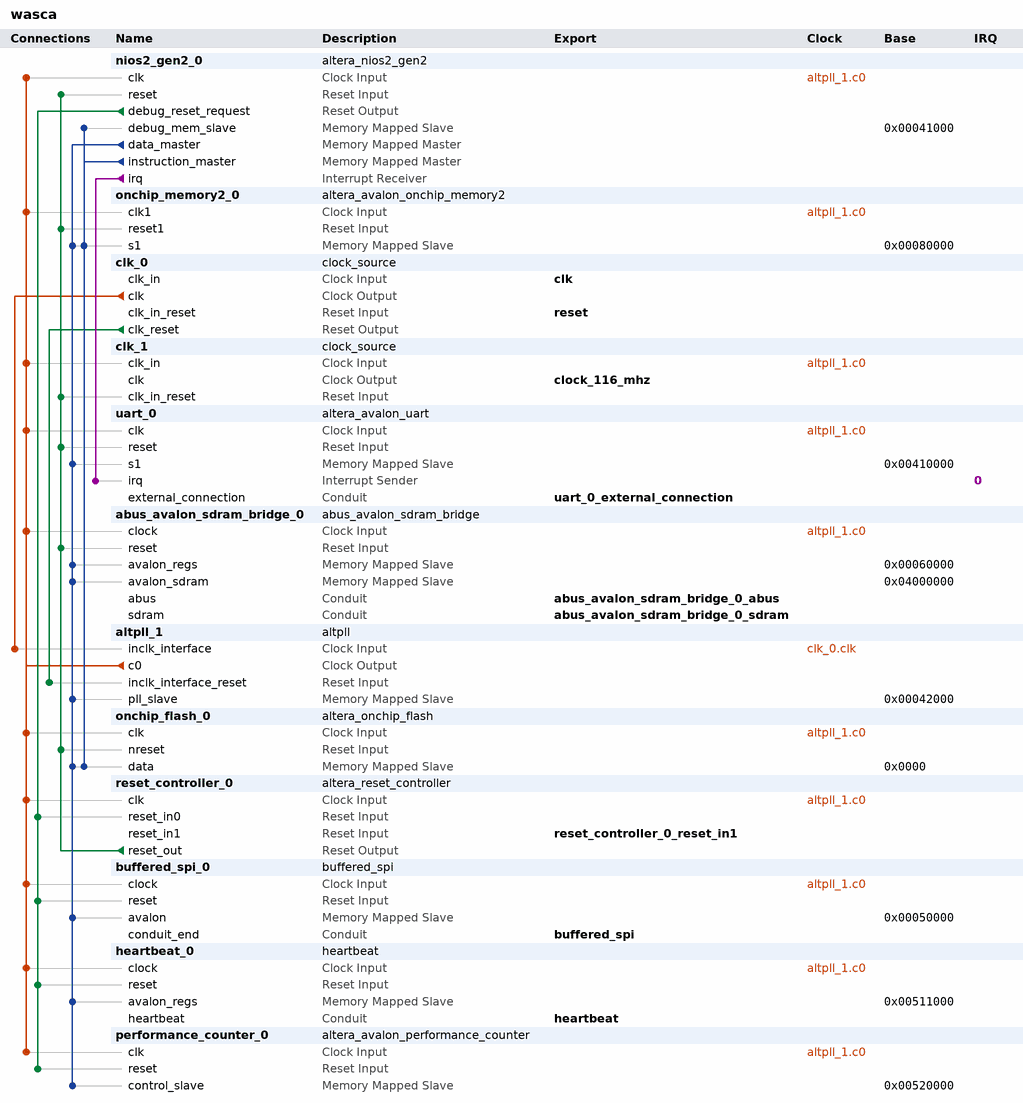
[diagram p0: system contents]
# Platform Designer (Qsys) system wasca, MAX 10 10M08SCE144C8G
# Parameters at their usual value, and those the tool derives, are not listed.
package require -exact qsys 18.1
create_system wasca
set_project_property DEVICE_FAMILY {MAX 10}
set_project_property DEVICE 10M08SCE144C8G

add_instance nios2_gen2_0 altera_nios2_gen2 18.1
set_instance_parameter_value nios2_gen2_0 dcache_size 0
set_instance_parameter_value nios2_gen2_0 debug_hwbreakpoint 4
set_instance_parameter_value nios2_gen2_0 exceptionOffset 16352
set_instance_parameter_value nios2_gen2_0 exceptionSlave onchip_flash_0.data
set_instance_parameter_value nios2_gen2_0 icache_size 0
set_instance_parameter_value nios2_gen2_0 impl Tiny
set_instance_parameter_value nios2_gen2_0 resetSlave onchip_flash_0.data
set_instance_parameter_value nios2_gen2_0 resetrequest_enabled false

add_instance onchip_memory2_0 altera_avalon_onchip_memory2 18.1
set_instance_parameter_value onchip_memory2_0 dataWidth 32
set_instance_parameter_value onchip_memory2_0 dualPort false
set_instance_parameter_value onchip_memory2_0 initMemContent false
set_instance_parameter_value onchip_memory2_0 initializationFileName onchip_mem.hex
set_instance_parameter_value onchip_memory2_0 memorySize 24576

add_instance clk_0 clock_source 18.1
set_instance_parameter_value clk_0 clockFrequency 8000000

add_instance clk_1 clock_source 18.1
set_instance_parameter_value clk_1 clockFrequency 116000000
set_instance_parameter_value clk_1 resetSynchronousEdges BOTH

add_instance uart_0 altera_avalon_uart 18.1
set_instance_parameter_value uart_0 baud 115200
set_instance_parameter_value uart_0 dataBits 8
set_instance_parameter_value uart_0 fixedBaud false
set_instance_parameter_value uart_0 parity NONE
set_instance_parameter_value uart_0 stopBits 1

add_instance abus_avalon_sdram_bridge_0 abus_avalon_sdram_bridge 1.0

add_instance altpll_1 altpll 18.1
set_instance_parameter_value altpll_1 CLK0_DIVIDE_BY 2
set_instance_parameter_value altpll_1 CLK0_MULTIPLY_BY 29
set_instance_parameter_value altpll_1 INCLK0_INPUT_FREQUENCY 125000
set_instance_parameter_value altpll_1 PORT_ARESET PORT_UNUSED
set_instance_parameter_value altpll_1 PORT_LOCKED PORT_UNUSED
set_instance_parameter_value altpll_1 PORT_clk1 PORT_UNUSED
set_instance_parameter_value altpll_1 PORT_clk2 PORT_UNUSED
set_instance_parameter_value altpll_1 PORT_clk3 PORT_UNUSED

add_instance onchip_flash_0 altera_onchip_flash 18.1
set_instance_parameter_value onchip_flash_0 CONFIGURATION_MODE {Single Compressed Image}
set_instance_parameter_value onchip_flash_0 SECTOR_ACCESS_MODE {Read only,Read only,Read only,Read only,Hidden}
set_instance_parameter_value onchip_flash_0 initFlashContent true
set_instance_parameter_value onchip_flash_0 initializationFileName altera_onchip_flash.hex
set_instance_parameter_value onchip_flash_0 useNonDefaultInitFile false

add_instance reset_controller_0 altera_reset_controller 18.1
set_instance_parameter_value reset_controller_0 NUM_RESET_INPUTS 2
set_instance_parameter_value reset_controller_0 SYNC_DEPTH 2

add_instance buffered_spi_0 buffered_spi 1.0

add_instance heartbeat_0 heartbeat 1.0

add_instance performance_counter_0 altera_avalon_performance_counter 18.1
set_instance_parameter_value performance_counter_0 numberOfSections 1

# connections
add_connection altpll_1.c0 abus_avalon_sdram_bridge_0.clock clock
add_connection altpll_1.c0 buffered_spi_0.clock clock
add_connection altpll_1.c0 clk_1.clk_in clock
add_connection altpll_1.c0 heartbeat_0.clock clock
add_connection altpll_1.c0 nios2_gen2_0.clk clock
add_connection altpll_1.c0 onchip_flash_0.clk clock
add_connection altpll_1.c0 onchip_memory2_0.clk1 clock
add_connection altpll_1.c0 performance_counter_0.clk clock
add_connection altpll_1.c0 reset_controller_0.clk clock
add_connection altpll_1.c0 uart_0.clk clock
add_connection clk_0.clk altpll_1.inclk_interface clock
add_connection clk_0.clk_reset altpll_1.inclk_interface_reset reset
add_connection nios2_gen2_0.debug_reset_request buffered_spi_0.reset reset
add_connection nios2_gen2_0.debug_reset_request heartbeat_0.reset reset
add_connection nios2_gen2_0.debug_reset_request performance_counter_0.reset reset
add_connection nios2_gen2_0.debug_reset_request reset_controller_0.reset_in0 reset
add_connection reset_controller_0.reset_out abus_avalon_sdram_bridge_0.reset reset
add_connection reset_controller_0.reset_out clk_1.clk_in_reset reset
add_connection reset_controller_0.reset_out nios2_gen2_0.reset reset
add_connection reset_controller_0.reset_out onchip_flash_0.nreset reset
add_connection reset_controller_0.reset_out onchip_memory2_0.reset1 reset
add_connection reset_controller_0.reset_out uart_0.reset reset
add_connection nios2_gen2_0.data_master abus_avalon_sdram_bridge_0.avalon_regs avalon
set_connection_parameter_value nios2_gen2_0.data_master/abus_avalon_sdram_bridge_0.avalon_regs baseAddress 0x00060000
add_connection nios2_gen2_0.data_master abus_avalon_sdram_bridge_0.avalon_sdram avalon
set_connection_parameter_value nios2_gen2_0.data_master/abus_avalon_sdram_bridge_0.avalon_sdram baseAddress 0x04000000
add_connection nios2_gen2_0.data_master altpll_1.pll_slave avalon
set_connection_parameter_value nios2_gen2_0.data_master/altpll_1.pll_slave baseAddress 0x00042000
add_connection nios2_gen2_0.data_master buffered_spi_0.avalon avalon
set_connection_parameter_value nios2_gen2_0.data_master/buffered_spi_0.avalon baseAddress 0x00050000
add_connection nios2_gen2_0.data_master heartbeat_0.avalon_regs avalon
set_connection_parameter_value nios2_gen2_0.data_master/heartbeat_0.avalon_regs baseAddress 0x00511000
add_connection nios2_gen2_0.data_master onchip_flash_0.data avalon
set_connection_parameter_value nios2_gen2_0.data_master/onchip_flash_0.data baseAddress 0x0000
add_connection nios2_gen2_0.data_master onchip_memory2_0.s1 avalon
set_connection_parameter_value nios2_gen2_0.data_master/onchip_memory2_0.s1 baseAddress 0x00080000
add_connection nios2_gen2_0.data_master performance_counter_0.control_slave avalon
set_connection_parameter_value nios2_gen2_0.data_master/performance_counter_0.control_slave baseAddress 0x00520000
add_connection nios2_gen2_0.data_master uart_0.s1 avalon
set_connection_parameter_value nios2_gen2_0.data_master/uart_0.s1 baseAddress 0x00410000
add_connection nios2_gen2_0.instruction_master nios2_gen2_0.debug_mem_slave avalon
set_connection_parameter_value nios2_gen2_0.instruction_master/nios2_gen2_0.debug_mem_slave baseAddress 0x00041000
add_connection nios2_gen2_0.instruction_master onchip_flash_0.data avalon
set_connection_parameter_value nios2_gen2_0.instruction_master/onchip_flash_0.data baseAddress 0x0000
add_connection nios2_gen2_0.instruction_master onchip_memory2_0.s1 avalon
set_connection_parameter_value nios2_gen2_0.instruction_master/onchip_memory2_0.s1 baseAddress 0x00080000
add_connection nios2_gen2_0.irq uart_0.irq interrupt
set_connection_parameter_value nios2_gen2_0.irq/uart_0.irq irqNumber 0

# exported interfaces
add_interface abus_avalon_sdram_bridge_0_abus conduit end
set_interface_property abus_avalon_sdram_bridge_0_abus EXPORT_OF abus_avalon_sdram_bridge_0.abus
add_interface abus_avalon_sdram_bridge_0_sdram conduit end
set_interface_property abus_avalon_sdram_bridge_0_sdram EXPORT_OF abus_avalon_sdram_bridge_0.sdram
add_interface buffered_spi conduit end
set_interface_property buffered_spi EXPORT_OF buffered_spi_0.conduit_end
add_interface clk clock sink
set_interface_property clk EXPORT_OF clk_0.clk_in
add_interface clock_116_mhz clock source
set_interface_property clock_116_mhz EXPORT_OF clk_1.clk
add_interface heartbeat conduit end
set_interface_property heartbeat EXPORT_OF heartbeat_0.heartbeat
add_interface reset reset sink
set_interface_property reset EXPORT_OF clk_0.clk_in_reset
add_interface reset_controller_0_reset_in1 reset sink
set_interface_property reset_controller_0_reset_in1 EXPORT_OF reset_controller_0.reset_in1
add_interface uart_0_external_connection conduit end
set_interface_property uart_0_external_connection EXPORT_OF uart_0.external_connection

set_interconnect_requirement {$system} qsys_mm.clockCrossingAdapter HANDSHAKE
set_interconnect_requirement {$system} qsys_mm.insertDefaultSlave FALSE
set_interconnect_requirement {$system} qsys_mm.maxAdditionalLatency 1

save_system wasca.qsys
